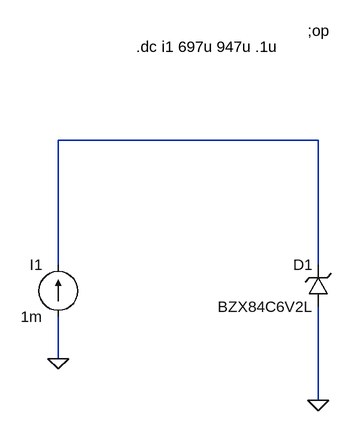
[diagram p0: schematic zener.asc]
zener.asc, the LTspice schematic file:
Version 4
SHEET 1 1284 680
WIRE 288 256 -112 256
WIRE -112 448 -112 256
WIRE 288 448 288 256
WIRE -112 592 -112 528
WIRE 288 656 288 512
FLAG 288 656 0
FLAG -112 592 0
SYMBOL zener 304 512 R180
WINDOW 0 24 64 Left 2
WINDOW 3 24 0 Left 2
SYMATTR InstName D1
SYMATTR Value BZX84C6V2L
SYMBOL current -112 528 R180
WINDOW 0 24 80 Left 2
WINDOW 3 24 0 Left 2
WINDOW 123 0 0 Left 0
WINDOW 39 0 0 Left 0
SYMATTR InstName I1
SYMATTR Value 1m
TEXT 272 88 Left 2 !;op
TEXT 8 112 Left 2 !.dc i1 697u 947u .1u

The netlist it stands for:
* zener.asc
D1 0 N001 BZX84C6V2L
I1 0 N001 1m
.model D D
.lib standard.dio
;op
.dc i1 697u 947u .1u
.backanno
.end